# EAGLE design Eagle_PCB Design (EAGLE 9.5.2)
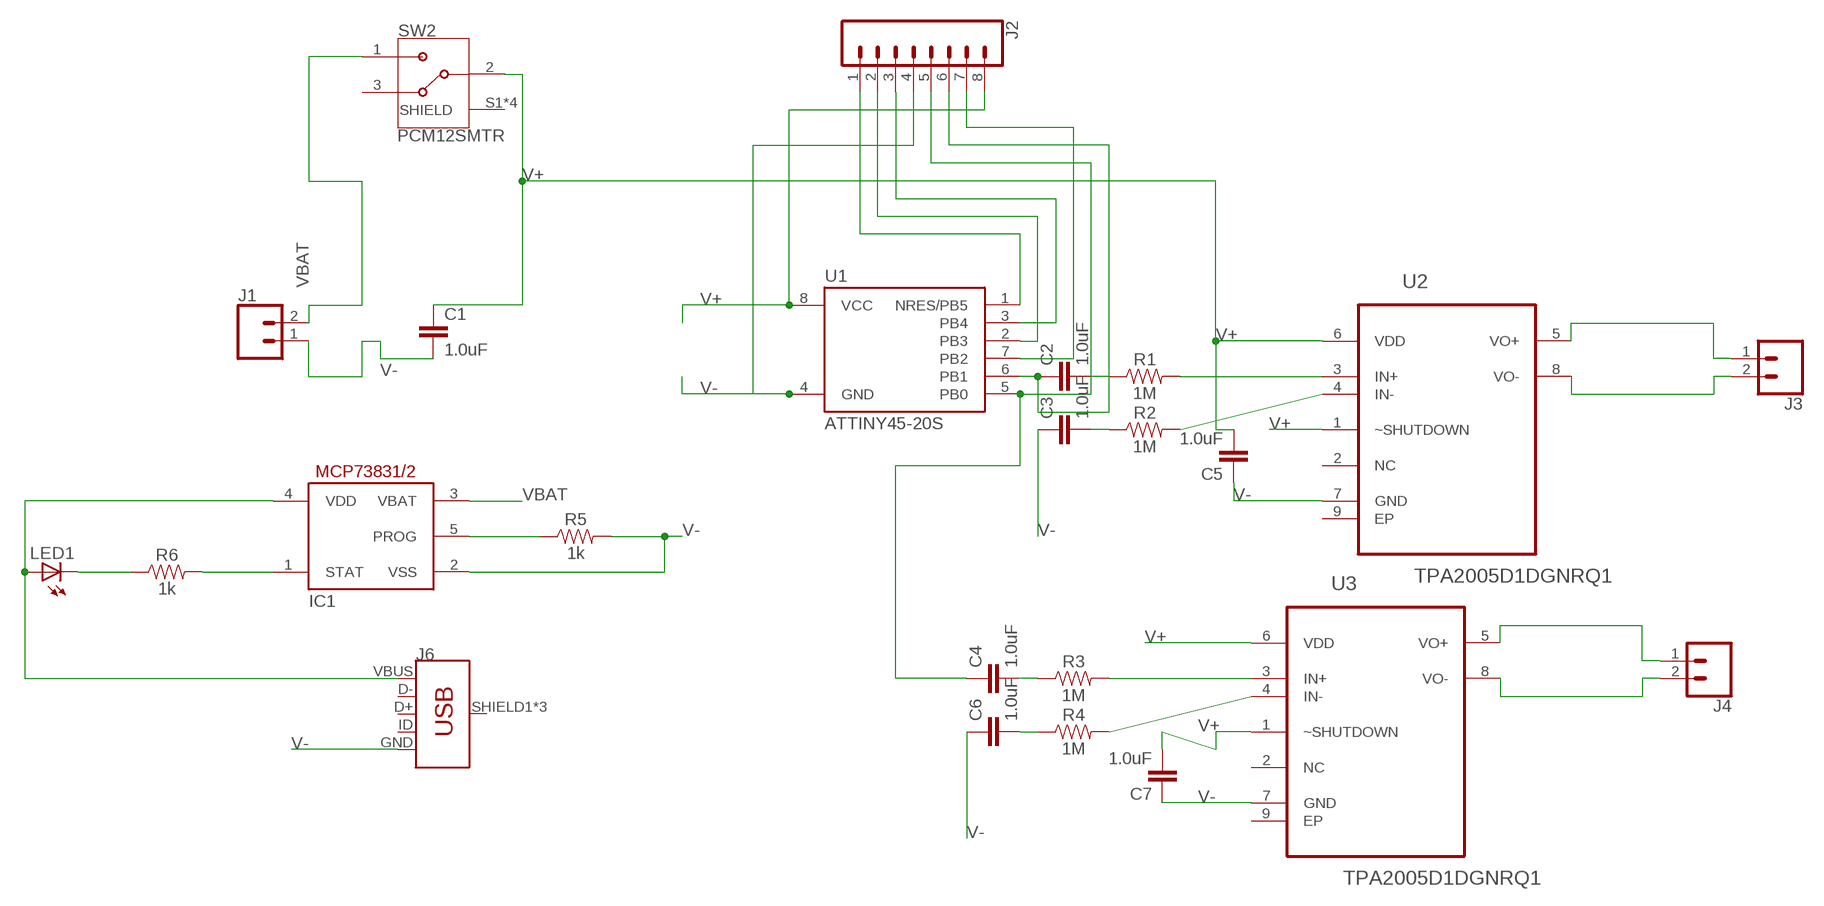
[diagram p0: schematic, sheet 1]

## Parts
C1  1.0uF  1.0UF-0603-16V-10%  [0603]
C2  1.0uF  1.0UF-0603-16V-10%  [0603]
C3  1.0uF  1.0UF-0603-16V-10%  [0603]
C4  1.0uF  1.0UF-0603-16V-10%  [0603]
C5  1.0uF  1.0UF-0603-16V-10%  [0603]
C6  1.0uF  1.0UF-0603-16V-10%  [0603]
C7  1.0uF  1.0UF-0603-16V-10%  [0603]
IC1  MCP73831/OT  [SOT23-5L]
J1  CONN_02PTH3  [1X02_LONGPADS]
J2  CONN_08NO_SILK_FEMALE_PTH  [1X08_NO_SILK]
J3  CONN_02PTH3  [1X02_LONGPADS]
J4  CONN_02PTH3  [1X02_LONGPADS]
J6  USB_MICRO-B_FEMALE-SMT  [USB-B-MICRO-SMD]
LED1  LEDCHIPLED_0603  [CHIPLED_0603]
R1  1M  1MOHM-0603-1/4W-5%  [0603]
R2  1M  1MOHM-0603-1/4W-5%  [0603]
R3  1M  1MOHM-0603-1/4W-5%  [0603]
R4  1M  1MOHM-0603-1/4W-5%  [0603]
R5  1k  1KOHM-0603-1/10W-1%  [0603]
R6  1k  1KOHM-0603-1/10W-1%  [0603]
SW2  PCM12SMTR  [SW_PCM12SMTR]
U1  ATTINY45-20S  [SOIC8_EIAJ_208MIL]
U2  TPA2005D1DGNRQ1  [SOP65P490X110-9N]
U3  TPA2005D1DGNRQ1  [SOP65P490X110-9N]

## Nets
N$1: C2.2 R1.1
N$2: R1.2 U2.3(IN+)
N$3: J3.1 U2.5(VO+)
N$4: J3.2 U2.8(VO-)
N$5: C2.1 J2.6 U1.6(PB1)
N$6: R2.2 U2.4(IN-)
N$7: C3.2 R2.1
N$8: C6.2 R4.1
N$9: J2.1 U1.1(NRES/PB5)
N$10: J2.2 U1.2(PB3)
N$11: J2.3 U1.3(PB4)
N$12: IC1.4(VDD) J6.VBUS LED1.A
N$13: J4.1 U3.5(VO+)
N$14: J2.7 U1.7(PB2)
N$15: J4.2 U3.8(VO-)
N$16: R3.2 U3.3(IN+)
N$17: R4.2 U3.4(IN-)
N$18: C4.2 R3.1
N$19: C4.1 J2.5 U1.5(PB0)
N$20: IC1.5(PROG) R5.1
N$21: LED1.C R6.1
N$22: IC1.1(STAT) R6.2
V+: C1.1 C5.2 C7.2 J2.8 SW2.2 U1.8(VCC) U2.1(~SHUTDOWN) U2.6(VDD) U3.1(~SHUTDOWN) U3.6(VDD)
V-: C1.2 C3.1 C5.1 C6.1 C7.1 IC1.2(VSS) J1.1 J2.4 J6.GND R5.2 U1.4(GND) U2.7(GND) U3.7(GND)
VBAT: IC1.3(VBAT) J1.2 SW2.1
Unconnected: J6.D+ J6.D- J6.ID J6.SHIELD1(SHIELD) J6.SHIELD2(SHIELD) J6.SHIELD3(SHIELD) SW2.3 SW2.S1(SHIELD) SW2.S2(SHIELD) SW2.S3(SHIELD) SW2.S4(SHIELD) U2.2(NC) U2.9(EP) U3.2(NC) U3.9(EP)

## Library data of the parts
C1-C7 = SparkFun-Capacitors:1.0UF: 1µF ceramic capacitors A capacitor is a passive two-terminal electrical component used to store electrical energy temporarily in an electric field.; PROD_ID: CAP-00868
IC1 = adafruit:MCP73831: MCP73831/2 Miniature Single-Cell, Fully Integrated Li-Ion, Li-Polymer Charge Management Controllers. Nice and small simple lipoly charge controller, with adjustable current and status output (LED) http://www.ladyada.net/library/pcb/eaglelibrary.html
J1 J3 J4 = SparkFun-Connectors:CONN_02: Multi connection point. Often used as Generic Header-pin footprint for 0.1 inch spaced/style header connections On any of the 0.1 inch spaced packages, you can populate with these: Break Away Headers - Straight <https://www.sparkfun.com/products/116> (PRT-00116) Break Away Male Headers - Right Angle <https://www.sparkfun.com/products/553> (PRT-00553) Female Headers <https://www.sparkfun.com/products/115> (PRT-00115) Break Away Headers - Machine Pin <https://www.sparkfun.com/products/117> (PRT-00117) Break Away Female Headers - Swiss Machine Pin <https://www.sparkfun.com/products/743> (PRT-00743) For SCREWTERMINALS and SPRING TERMINALS visit here: Screw Terimnals on SparkFun.com <https://www.sparkfun.com/search/results?term=Screw+Terminals> (5mm/3.5mm/2.54mm spacing) This device is also useful as a general connection point to wire up your design to another part of your project. Our various solder wires solder well into these plated through hole pads. Hook-Up Wire - Assortment (Stranded, 22 AWG) <https://www.sparkfun.com/products/11375> (PRT-11375) Hook-Up Wire - Assortment (Solid Core, 22 AWG) <https://www.sparkfun.com/products/11367> (PRT-11367) View the entire wire category on our website here <https://www.sparkfun.com/categories/141> Special notes: Molex polarized connector foot print use with: PRT-08233 with associated crimp pins and housings. 2.54_SCREWTERM for use with PRT-10571. 3.5mm Screw Terminal footprints for PRT-08084 5mm Screw Terminal footprints for use with PRT-08432
J2 = SparkFun-Connectors:CONN_08: Multi connection point. Often used as Generic Header-pin footprint for 0.1 inch spaced/style header connections On any of the 0.1 inch spaced packages, you can populate with these: Break Away Headers - Straight <https://www.sparkfun.com/products/116> (PRT-00116) Break Away Male Headers - Right Angle <https://www.sparkfun.com/products/553> (PRT-00553) Female Headers <https://www.sparkfun.com/products/115> (PRT-00115) Break Away Headers - Machine Pin <https://www.sparkfun.com/products/117> (PRT-00117) Break Away Female Headers - Swiss Machine Pin <https://www.sparkfun.com/products/743> (PRT-00743) Arduino Stackable Header - 8 Pin <https://www.sparkfun.com/products/9279> (PRT-09279) For SCREWTERMINALS and SPRING TERMINALS visit here: Screw Terimnals on SparkFun.com <https://www.sparkfun.com/search/results?term=Screw+Terminals> (5mm/3.5mm/2.54mm spacing) This device is also useful as a general connection point to wire up your design to another part of your project. Our various solder wires solder well into these plated through hole pads. Hook-Up Wire - Assortment (Stranded, 22 AWG) <https://www.sparkfun.com/products/11375> (PRT-11375) Hook-Up Wire - Assortment (Solid Core, 22 AWG) <https://www.sparkfun.com/products/11367> (PRT-11367) View the entire wire category on our website here <https://www.sparkfun.com/categories/141> Special notes: Molex polarized connector foot print use with SKU : PRT-08231 with associated crimp pins and housings. 1MM SMD Version SKU: PRT-10208 NOTES ON THE VARIANTS LOCK and LOCK_LONGPADS... This footprint was designed to help hold the alignment of a through-hole component (i.e. 6-pin header) while soldering it into place. You may notice that each hole has been shifted either up or down by 0.005 of an inch from it's more standard position (which is a perfectly straight line). This slight alteration caused the pins (the squares in the middle) to touch the edges of the holes. Because they are alternating, it causes a "brace" to hold the component in place. 0.005 has proven to be the perfect amount of "off-center" position when using our standard breakaway headers. Although looks a little odd when you look at the bare footprint, once you have a header in there, the alteration is very hard to notice. Also,if you push a header all the way into place, it is covered up entirely on the bottom side.; PROD_ID: CONN-08438
J6 = SparkFun-Connectors:USB_MICRO-B: USB Type Micro-B Connector Male/female and PTH/SMT variants SparkFun Products: SparkFun microB USB Breakout <https://www.sparkfun.com/products/12035> SparkFun USB microB Plug Breakout <https://www.sparkfun.com/products/10031> SparkFun ESP8266 Thing <https://www.sparkfun.com/products/13231>; PROD_ID: CONN-11752
LED1 = adafruit:LED: LED OSRAM: - CHIPLED LG R971, LG N971, LY N971, LG Q971, LY Q971, LO R971, LY R971 LH N974, LH R974 LS Q976, LO Q976, LY Q976 LO Q996 - Hyper CHIPLED LW Q18S LB Q993, LB Q99A, LB R99A - SideLED LS A670, LO A670, LY A670, LG A670, LP A670 LB A673, LV A673, LT A673, LW A673 LH A674 LY A675 LS A676, LA A676, LO A676, LY A676, LW A676 LS A679, LY A679, LG A679 - Hyper Micro SIDELED® LS Y876, LA Y876, LO Y876, LY Y876 LT Y87S - SmartLED LW L88C, LW L88S LB L89C, LB L89S, LG L890 LS L89K, LO L89K, LY L89K LS L896, LA L896, LO L896, LY L896 - TOPLED LS T670, LO T670, LY T670, LG T670, LP T670 LSG T670, LSP T670, LSY T670, LOP T670, LYG T670 LG T671, LOG T671, LSG T671 LB T673, LV T673, LT T673, LW T673 LH T674 LS T676, LA T676, LO T676, LY T676, LB T676, LH T676, LSB T676, LW T676 LB T67C, LV T67C, LT T67C, LS T67K, LO T67K, LY T67K, LW E67C LS E67B, LA E67B, LO E67B, LY E67B, LB E67C, LV E67C, LT E67C LW T67C LS T679, LY T679, LG T679 LS T770, LO T770, LY T770, LG T770, LP T770 LB T773, LV T773, LT T773, LW T773 LH T774 LS E675, LA E675, LY E675, LS T675 LS T776, LA T776, LO T776, LY T776, LB T776 LHGB T686 LT T68C, LB T68C - Hyper Mini TOPLED® LB M676 - Mini TOPLED Santana® LG M470 LS M47K, LO M47K, LY M47K Source: http://www.osram.convergy.de/
R1-R4 = SparkFun-Resistors:1MOHM: 1MΩ resistor A resistor is a passive two-terminal electrical component that implements electrical resistance as a circuit element. Resistors act to reduce current flow, and, at the same time, act to lower voltage levels within circuits. - Wikipedia; PROD_ID: RES-07868
R5 R6 = SparkFun-Resistors:1KOHM: 1kΩ resistor A resistor is a passive two-terminal electrical component that implements electrical resistance as a circuit element. Resistors act to reduce current flow, and, at the same time, act to lower voltage levels within circuits. - Wikipedia; PROD_ID: RES-07856
SW2 = PCM12SMTR:PCM12SMTR: Switch Slide ON ON SPDT Side Slide 0.3A 6VDC 10000Cycles Gull Wing SMD T/R; DESCRIPTION: Slide Switch SPDT Surface Mount, Right Angle; DIGI-KEY_PART_NUMBER: 401-2016-1-ND; DIGI-KEY_PURCHASE_URL: https://www.digikey.com/product-detail/en/c-k/PCM12SMTR/401-2016-1-ND/1640125?utm_source=snapeda&utm_medium=aggregator&utm_campaign=symbol; MF: C&K; MP: PCM12SMTR; PACKAGE: DO-201 C&amp;K Components
U1 = _hhn_attiny25_45_85:ATTINY45*: ATMEL ATtiny 45 Packages: P = PDIP 08 30mil S = SOIC 08 EIAJ 208mil X = TSSOP 08 4.4mm Technologies Note: for complete ordering code (temp. range, finish, tape&reel etc.) see www.atmel.com • Supply Voltage: V = (1.8…5.5)V | [blank] = (2.7…5.5)V • Speed: 10 = 10 MHz | 20 = 20 MHz Author: Dipl.-Ing. FH Rainer Bayer HHN Hochschule Heilbronn (Heilbronn University), rainer.bayer@hs-heilbronn.de Ingenieurbüro ing-rb, mail@ing-rb.de
U2 U3 = Texas Instruments_By_element14_Batch_1:TPA2005D1DGNRQ1: 1.4-W MONO FILTER-FREE CLASS-D AUDIO POWER AMPLIFIER; MPN: TPA2005D1DGNRQ1; OC_FARNELL: -; OC_NEWARK: 52P6804; PACKAGE: MSOP-8; SUPPLIER: Texas Instruments

## Board
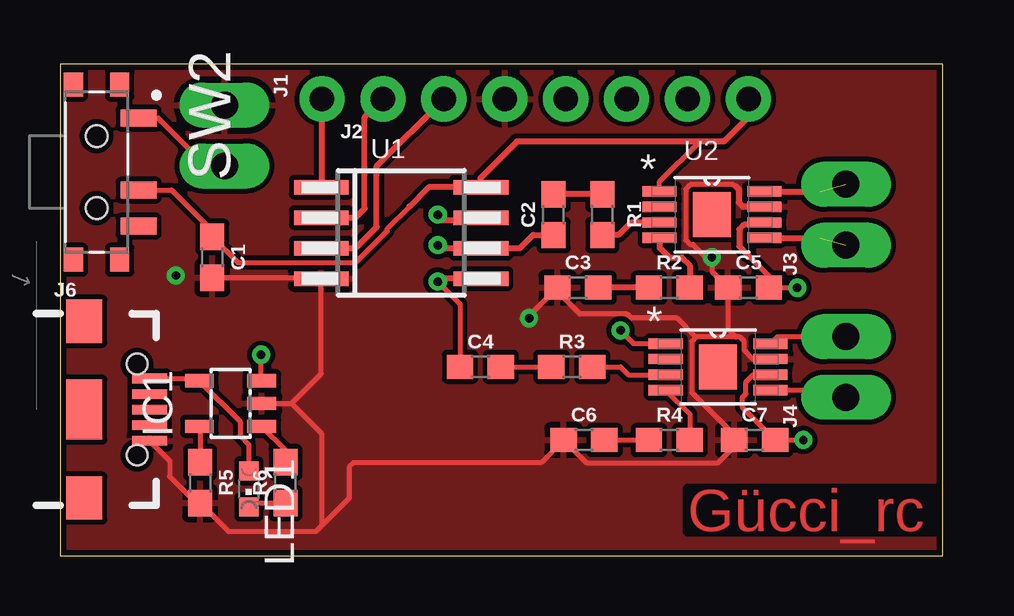
[diagram p1: board, top side]
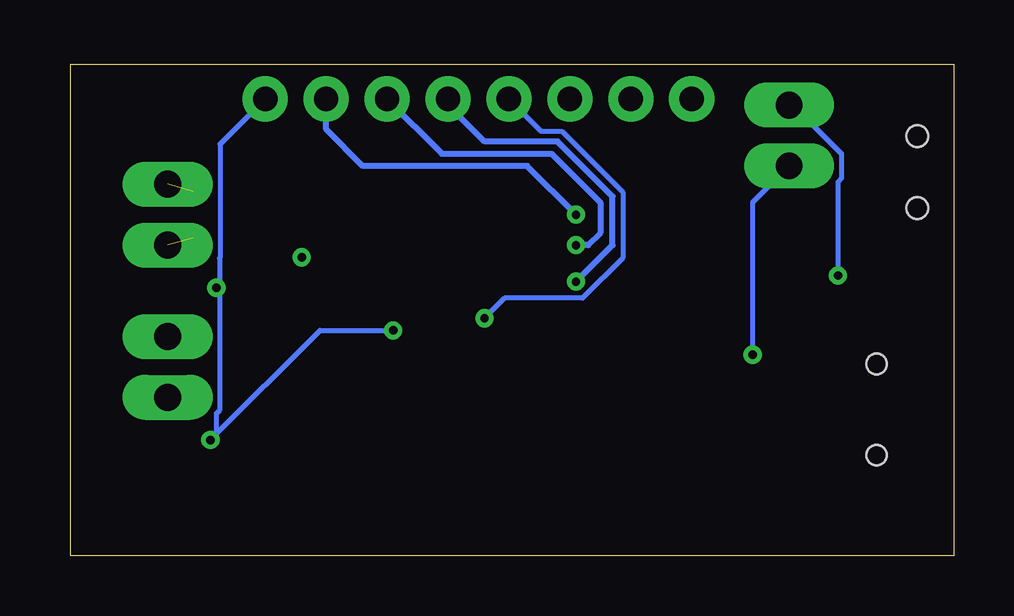
[diagram p2: board, bottom side, seen from below]

Size 36.81 x 20.5 mm. Coordinates in mm from the lower left corner, seen from the top.
Outline: 0,0 36.81,0 36.81,20.5 0,20.5 0,0
Copper layers (1*16): Top 0.035mm / dielectric 1.5mm / Bottom 0.035mm
Design rules "default *": minimum track width 8mil, minimum drill 0.35mm, track to track 8mil, track to pad 8mil, pad to pad 8mil, via to via 8mil, smd to smd 8mil, copper to edge 10mil, drill to drill 8mil, minimum pad ring 10mil, minimum via ring 8mil, stop-mask expansion 4mil, vias tented up to drill 0mil, thermal gap 10mil

### Footprints (pad centres in the part's own frame; a part is rotated, then mirrored left to right if it is on the bottom)
0603 = smd 1.1 x 1: 1 -0.85,0; 2 0.85,0
SOT23-5L = smd 0.55 x 1.2: 1 -0.95,-1.3; 2 0,-1.3; 3 0.95,-1.3; 4 0.95,1.3; 5 -0.95,1.3
1X02_LONGPADS = drill 1.118 pad 1.88 long: 1 0,0; 2 2.54,0
1X08_NO_SILK = drill 1.016 pad 1.88: 1 0,0; 2 2.54,0; 3 5.08,0; 4 7.62,0; 5 10.16,0; 6 12.7,0; 7 15.24,0; 8 17.78,0
USB-B-MICRO-SMD = smd 1.45 x 0.4: D+ 2.725,0; D- 2.725,0.65; GND 2.725,-1.3; ID 2.725,-0.65; VBUS 2.725,1.3 | smd 1.5 x 1.8: SHIELD1 0,3.685; SHIELD2 0,-3.685 | smd 1.5 x 2.5: SHIELD3 0,0 | hole 0.85: 2.2,1.9; 2.2,-1.9
CHIPLED_0603 = smd 0.8 x 0.8: A 0,-0.75; C 0,0.75
SW_PCM12SMTR = smd 0.7 x 1.5: 1 -2.25,1.75; 2 0.75,1.75; 3 2.25,1.75 | smd 1 x 0.8: S1 -3.65,0.965; S2 -3.65,-0.965; S3 3.65,-0.965; S4 3.65,0.965 | hole 0.9: -1.5,0; 1.5,0
SOIC8_EIAJ_208MIL = smd 0.6 x 2.286: 1 -1.905,-3.33; 2 -0.635,-3.33; 3 0.635,-3.33; 4 1.905,-3.33; 5 1.905,3.33; 6 0.635,3.33; 7 -0.635,3.33; 8 -1.905,3.33
SOP65P490X110-9N = smd 1.422 x 0.432: 1 -2.184,0.965; 2 -2.184,0.33; 3 -2.184,-0.33; 4 -2.184,-0.965; 5 2.184,-0.965; 6 2.184,-0.33; 7 2.184,0.33; 8 2.184,0.965 | smd 1.575 x 1.88: 9 0,0

### Placement (x,y rotation side)
C1  6.35,12.45 270 top
C2  20.57,14.22 90 top
C3  21.59,11.18 0 top
C4  17.53,7.87 0 top
C5  28.7,11.18 0 top
C6  21.84,4.83 0 top
C7  28.96,4.83 0 top
IC1  7.11,6.35 90 top
J1  6.86,18.8 270 top
J2  10.92,19.05 0 top
J3  32.77,12.95 90 top
J4  32.77,6.6 90 top
J6  1.02,6.1 0 top
LED1  7.87,2.79 180 top
R1  22.61,14.22 270 top
R2  25.4,11.18 0 top
R3  21.34,7.87 0 top
R4  25.4,4.83 0 top
R5  5.84,3.05 270 top
R6  9.4,3.05 90 top
SW2  1.52,16 270 top
U1  14.22,13.46 270 top
U2  27.18,14.22 0 top
U3  27.43,7.87 0 top

### Tracks (layer width: path | path; a pad name or v marks a point on that pad's centre or on a via)
N$1
  Top 0.254: R1.1 C2.2
N$2
  Top 0.254: U2.3 23.8,13.89 23.28,13.37 R1.2
N$3  (1 unrouted)
  Top 0.254: U2.5 31.7,13.26
N$4  (1 unrouted)
  Top 0.254: U2.8 31.7,15.19
N$5  (via drill 0.35)
  Top 0.254: C2.1 19.72,13.37 19.18,12.83 U1.6 15.88,12.83 v15.75,12.95
  Bottom 0.254: J2.6 21.34,16.76 16.76,16.76 14.73,14.73 14.73,13.46 15.24,12.95 v15.75,12.95
N$6
  Top 0.254: U2.4 24.99,12.85 25.4,12.45 25.91,12.45 26.25,12.1 R2.2
N$7
  Top 0.254: R2.1 C3.2
N$8
  Top 0.203: C6.2 R4.1
N$9
  Top 0.254: U1.1 10.92,15.39 J2.1
N$10
  Top 0.254: U1.2 12.32,14.1 12.7,14.48 12.7,18.29 J2.2
N$11
  Top 0.254: U1.3 12.32,12.83 13.21,13.72 13.21,16.26 J2.3
N$12
  Top 0.203: J6.VBUS 5.72,7.4 IC1.4 7.51,5.6 7.51,5 7.87,4.63 LED1.A
N$13
  Top 0.203: U3.5 32.46,6.91 J4.1
N$14  (via drill 0.35)
  Top 0.254: U1.7 17.43,13.97 15.75,13.97 v15.75,14.22
  Bottom 0.254: v15.75,14.22 17.78,16.26 24.64,16.26 26.16,17.78 J2.7
N$15
  Top 0.203: U3.8 29.92,9.14 J4.2
N$16
  Top 0.203: R3.2 23.37,7.87 23.7,7.54 U3.3
N$17
  Top 0.203: U3.4 26.25,5.91 R4.2
N$18
  Top 0.203: C4.2 R3.1
N$19  (via drill 0.35)
  Top 0.203: v15.75,11.43 16.68,10.5 C4.1
  Top 0.254: U1.5 15.88,11.56 v15.75,11.43
  Bottom 0.254: v15.75,11.43 14.22,12.95 14.22,14.99 16.51,17.27 19.56,17.27 21.08,18.8 J2.5
N$20
  Top 0.203: IC1.5 5.84,5.37 R5.1
N$21
  Top 0.203: LED1.C 8.03,2.2 R6.1
N$22
  Top 0.203: IC1.1 9.4,4.41 R6.2
V+  (via drill 0.35)
  Top 0.203: U2.1 24.99,15.6 26.67,17.27 | SW2.2 4.65,15.25 6.35,13.56 C1.1 7.42,12.22 12.33,12.22 13.64,13.54 13.64,13.64 14.57,14.57 | 28.7,12.52 29.55,11.67 C5.2 v30.73,11.18 | U3.6 28.89,7.54 28.6,7.25 28.6,6.76 28.45,6.6 28.45,6.18 C7.2 v30.99,4.83 | U3.1 23.93,8.84 v23.37,9.4
  Top 0.254: U1.8 17.53,15.37 | 17.53,15.37 15.37,15.37 14.57,14.57 | U2.6 29.27,13.8 28.51,13.8 28.32,13.61 28.32,12.91 28.7,12.52 | J2.8 28.7,18.29 27.69,17.27 26.67,17.27 19.05,17.27 17.53,15.75 17.53,15.37
  Bottom 0.203: 30.61,11.05 30.58,11.02 30.58,6.09 30.73,5.94 30.73,5.08 v30.99,4.83 26.42,9.4 v23.37,9.4 | 30.61,11.05 v30.73,11.18 | 30.61,11.05 30.61,12.41 30.58,12.44 30.58,17.17 J2.8
V-  (via drill 0.35)
  Top 0.203: C1.2 10.85,11.6 U1.4 10.89,7.59 9.65,6.35 | J6.GND 4.57,3.96 4.57,3.3 5.68,2.2 R5.2 7.02,1.02 10.67,1.02 10.92,1.27 | 9.65,6.35 10.92,5.08 10.92,1.27 | IC1.2 9.65,6.35 | 28.19,9.12 28.35,9.12 28.52,8.94 28.52,8.57 28.89,8.2 U3.7 | 28.19,9.12 26.52,9.12 | 26.52,9.12 26.34,8.94 26.34,6.81 28.11,5.04 C7.1 28.11,4.55 27.43,3.88 21.94,3.88 C6.1 20.05,3.88 12.23,3.88 12.06,3.7 12.06,2.4 10.92,1.27 | 28.19,9.12 27.85,9.46 C5.1 27.18,11.85 27.18,12.19 | v27.18,12.45 27.18,12.19 | 28.19,15.4 28.16,15.4 28.09,15.47 26.26,15.47 26.09,15.29 26.09,13.16 26.26,12.98 26.39,12.98 27.18,12.19 | v19.56,9.91 19.56,9.99 20.66,11.09 | 20.66,11.09 C3.1 | 20.66,11.09 21.67,10.08 23.65,10.08 23.83,9.91 25.73,9.91 26.52,9.12
  Top 0.254: U2.7 28.47,14.55 28.3,14.73 28.3,15.3 28.19,15.4
  Bottom 0.203: J1.1 6.7,18.8 4.67,16.77 4.67,15.74 4.83,15.59 v4.83,11.68 | J2.4 17.2,17.7 16.33,17.7 13.79,15.16 13.79,12.42 15.47,10.75 18.72,10.75 v19.56,9.91
  pour Top: 0.25,0.25 0.25,20.32 36.58,20.32 36.58,0.25
VBAT  (via drill 0.35)
  Top 0.203: SW2.1 4.1,18.25 6.1,16.26 J1.2 | IC1.3 8.38,7.33 v8.38,8.38
  Bottom 0.203: J1.2 8.38,14.73 v8.38,8.38

### Text on the board
Top: Gücci_rc